# EasyEDA Pro project N630电调_立创EDA专业版工程.epro, schematic Schematic1

## Sheets
1 框图: Board Name: Board1; Create Date: 2025-09-22; Page Name: 框图; Project Name: N630电调; Schematic Name: Schematic1; Update Date: 2025-09-22; Company: 嘉立创EDA; Page Size: A4; Version: V1.0
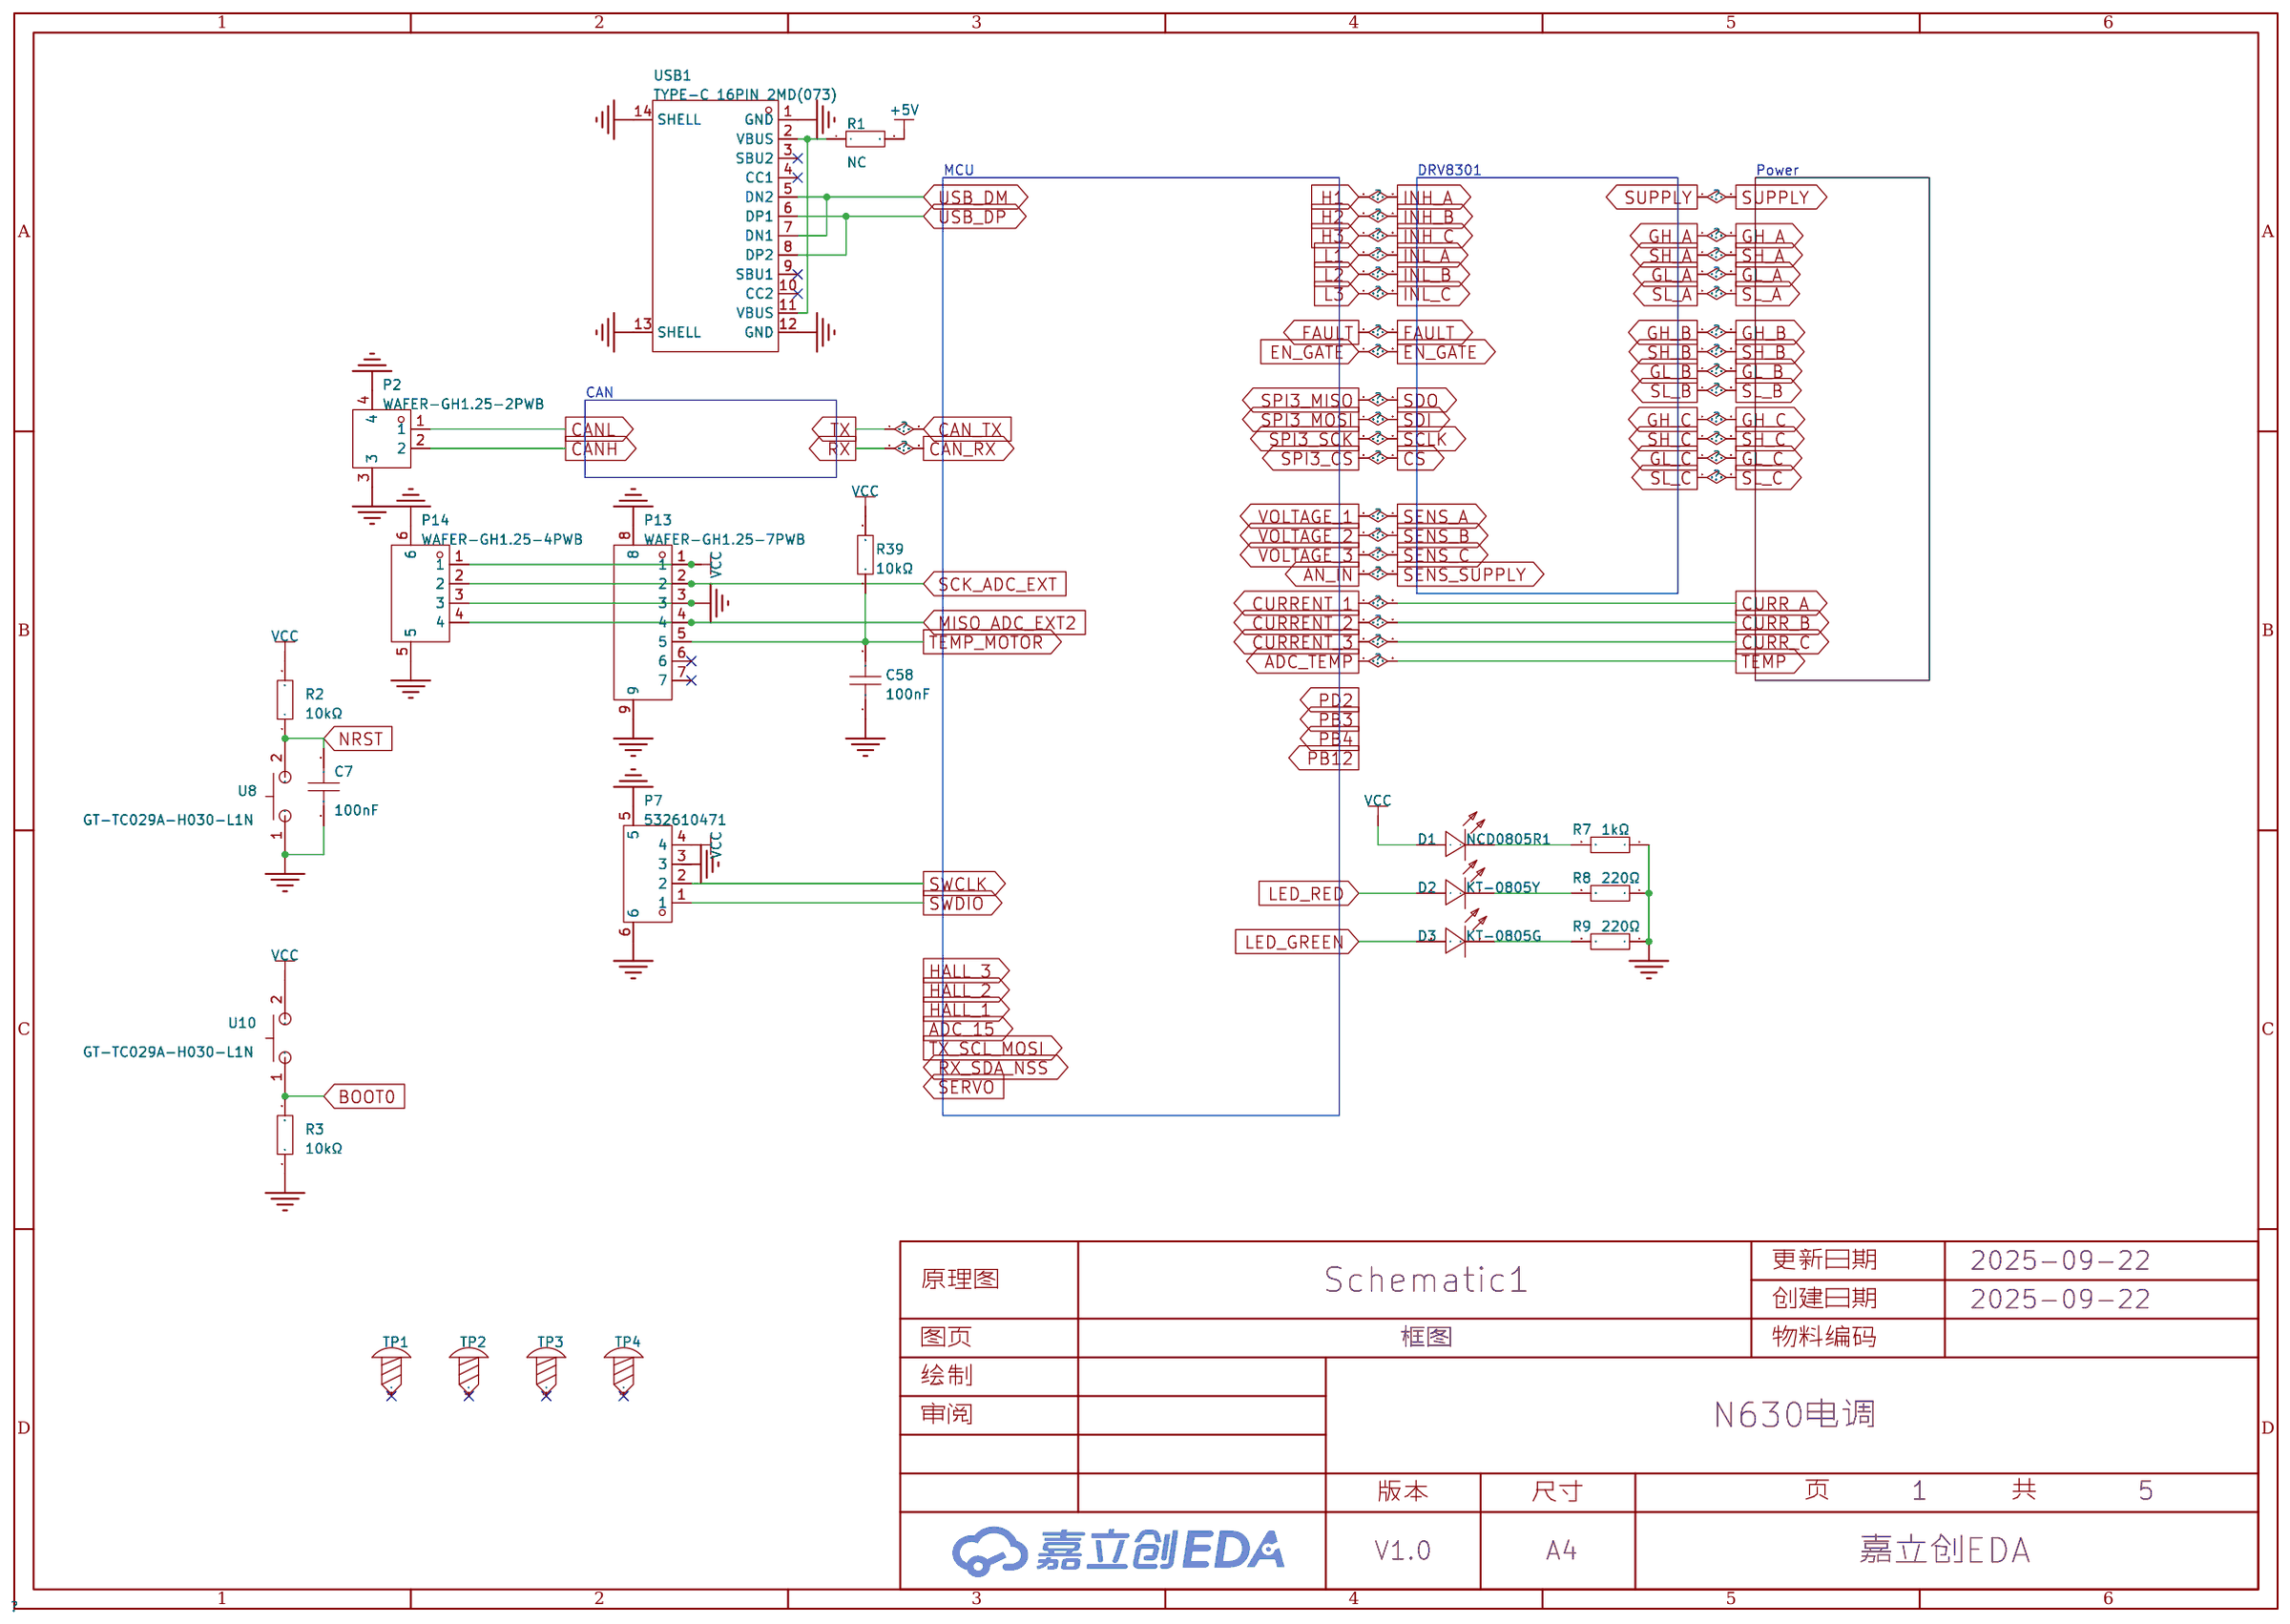
[diagram p0: 框图]
2 MCU: Create Date: 2025-07-19; Page Name: MCU; Project Name: VESC电调_V4; Update Date: 2025-07-19
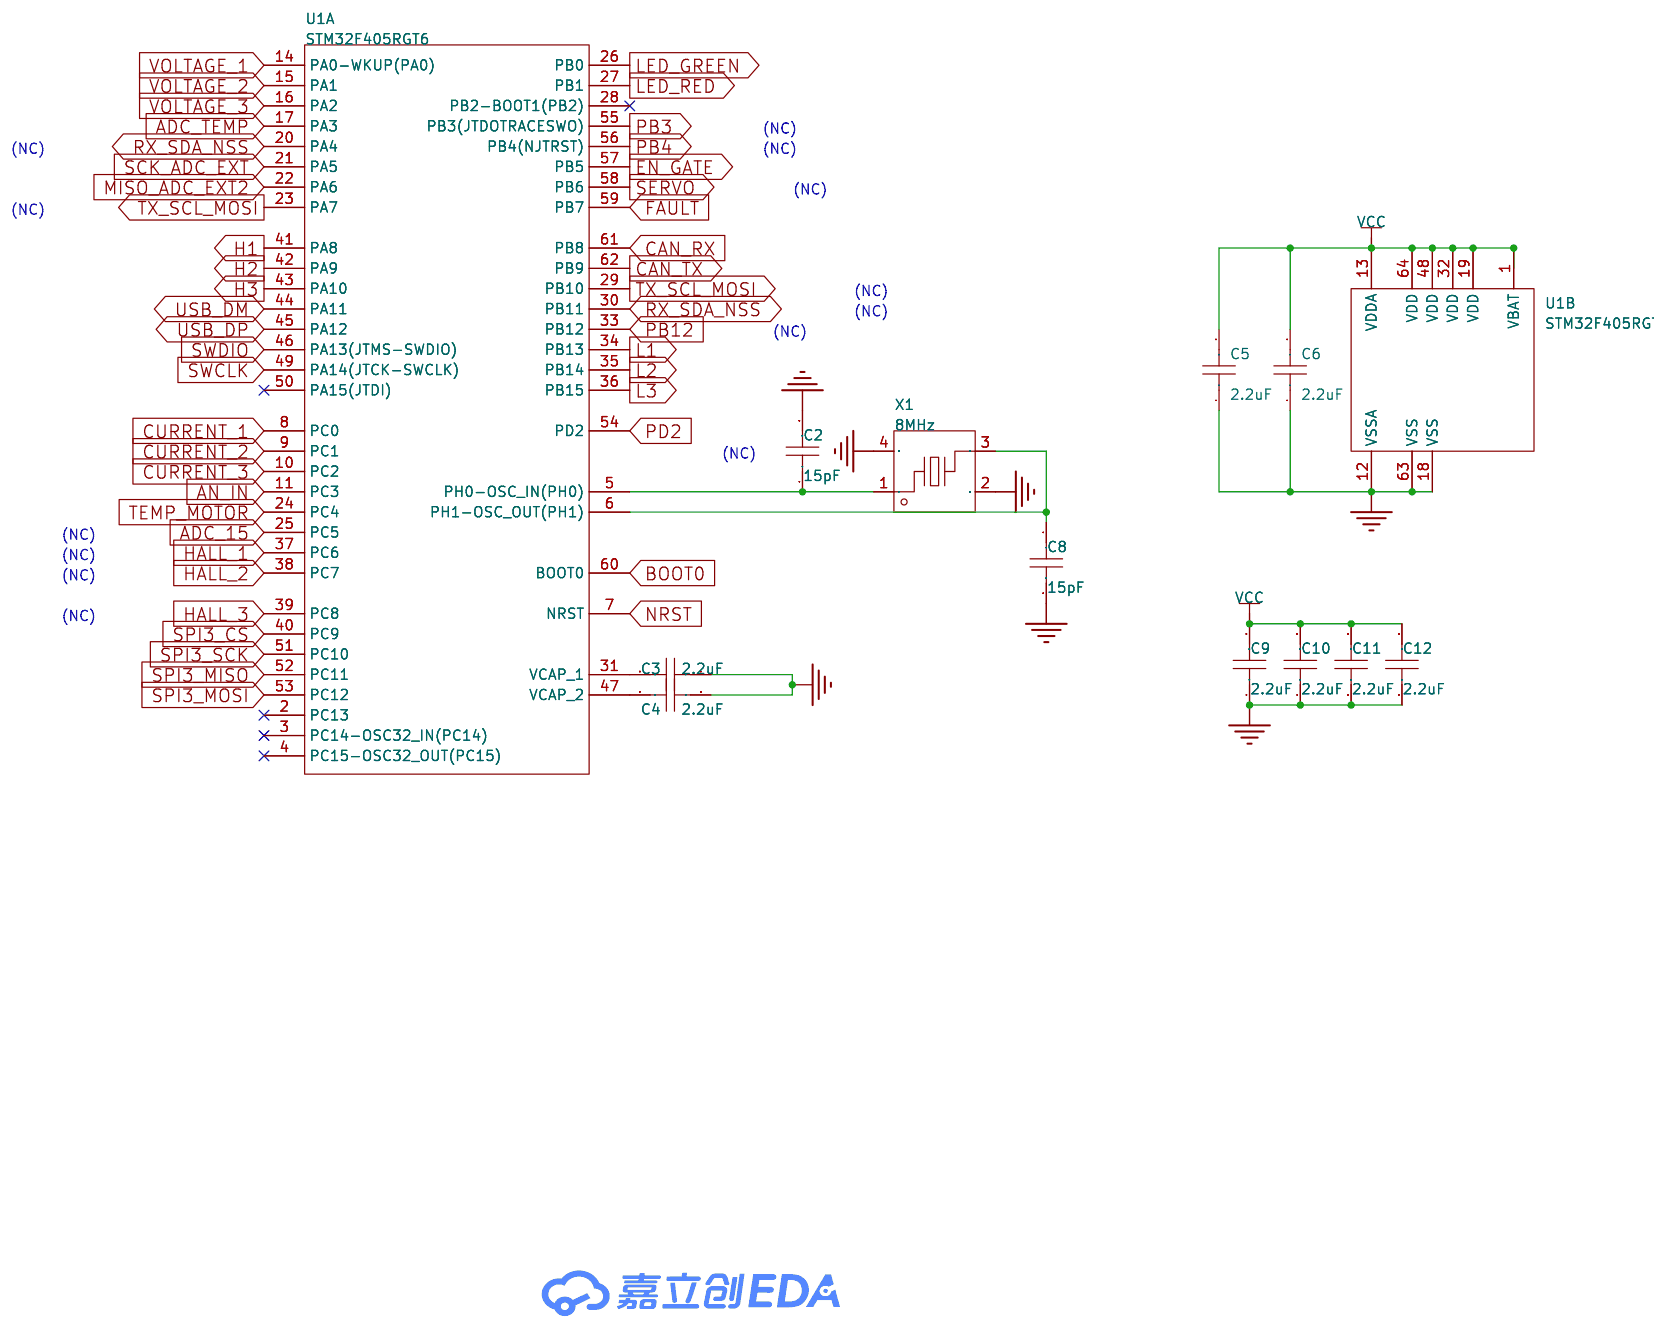
[diagram p1: MCU]
3 DRV8301: Create Date: 2025-08-27; Page Name: DRV8301; Project Name: VESC电调_V5; Update Date: 2025-08-27
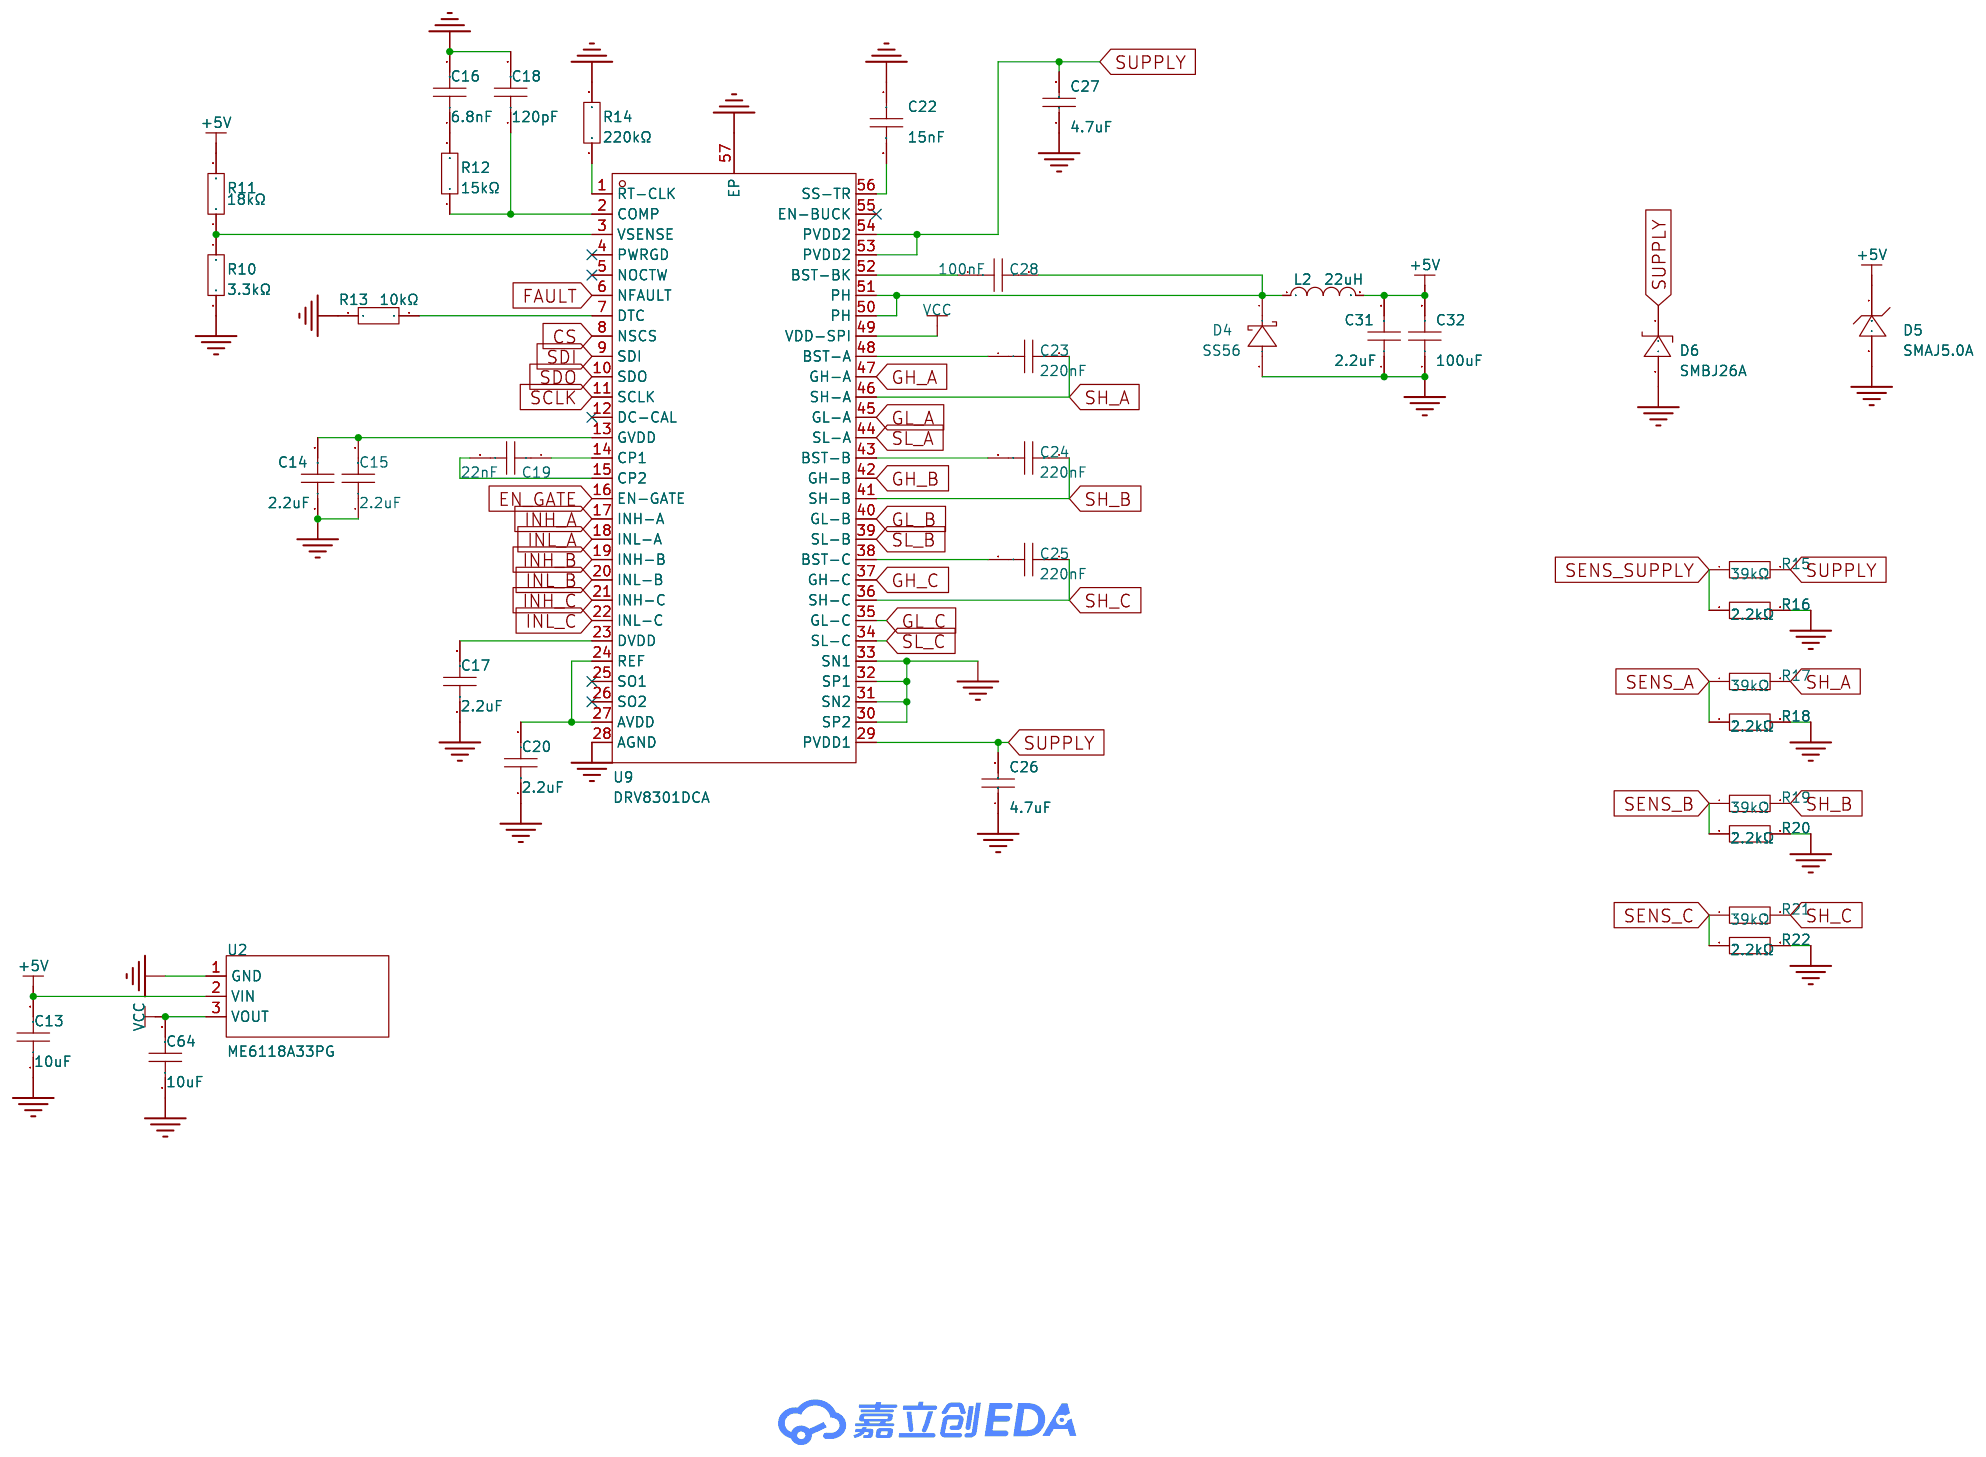
[diagram p2: DRV8301]
4 Power: Create Date: 2025-08-27; Page Name: Power; Project Name: VESC电调_V5; Update Date: 2025-08-27
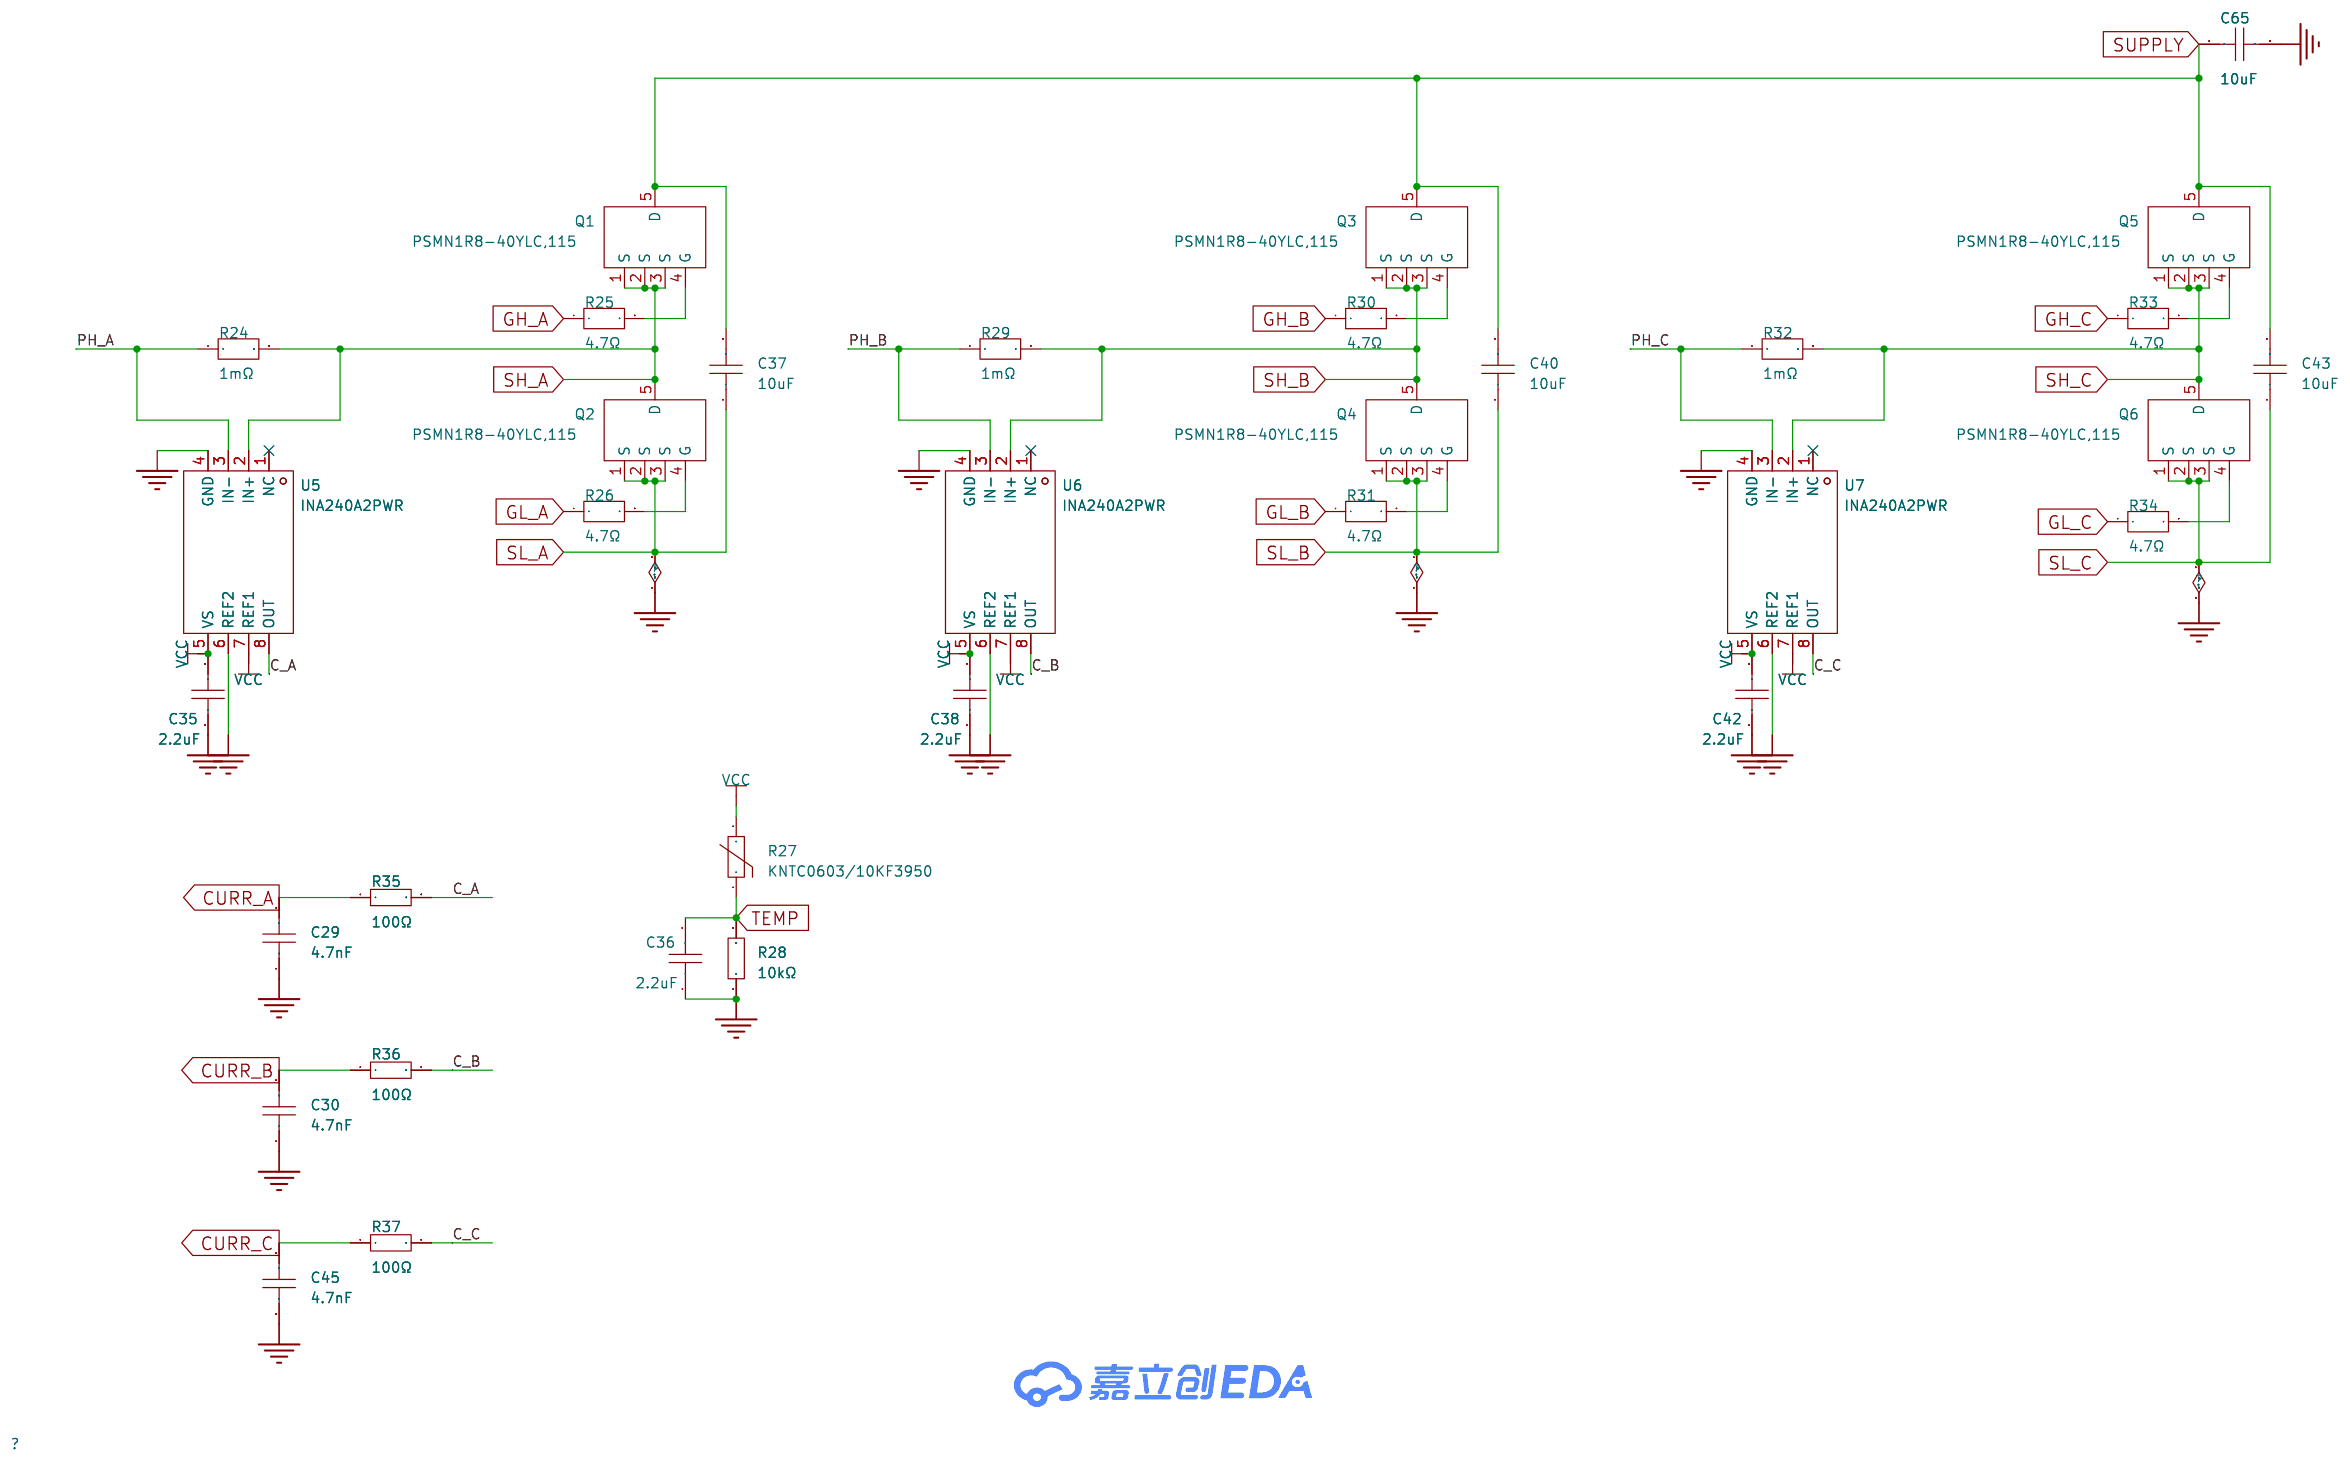
[diagram p3: Power]
5 CAN: Create Date: 2025-09-16; Page Name: CAN; Project Name: N630电调_V6; Update Date: 2025-09-16
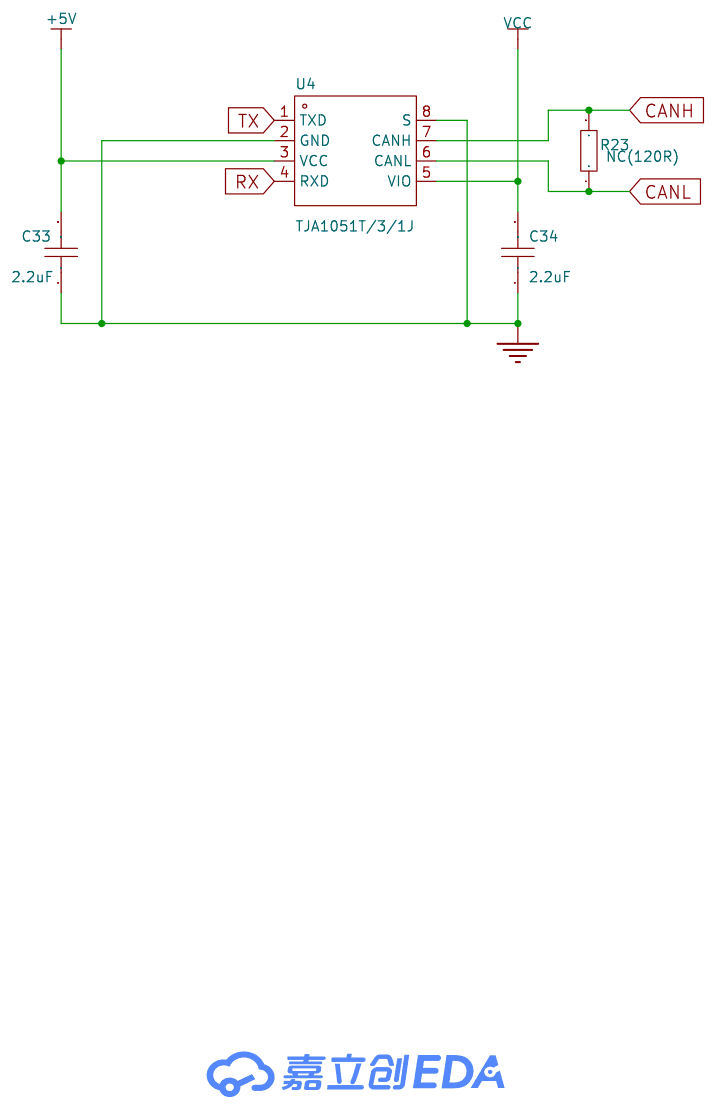
[diagram p4: CAN]

## Parts
sheet CAN
C33  2.2uF  [C0603]
C34  2.2uF  [C0603]
R23  NC(120R)  [R0805]
U4  TJA1051T/3/1J  [SOIC-8_L4.9-W3.9-P1.27-LS6.0-BL]
sheet DRV8301
C13  10uF  [C0603]
C14  2.2uF  [C0603]
C15  2.2uF  [C0603]
C16  6.8nF  [C0603]
C17  2.2uF  [C0603]
C18  120pF  [C0603]
C19  22nF  [C0603]
C20  2.2uF  [C0603]
C22  15nF  [C0603]
C23  220nF  [C0603]
C24  220nF  [C0603]
C25  220nF  [C0603]
C26  4.7uF  [C1206]
C27  4.7uF  [C1206]
C28  100nF  [C0603]
C31  2.2uF  [C0603]
C32  100uF  [C1206]
C64  10uF  [C0603]
D4  SS56  [SMA_L4.3-W2.6-LS5.0-RD]
D5  SMAJ5.0A  [SMA_L4.3-W2.6-LS5.2-RD]
D6  SMBJ26A  [SMB_L4.4-W3.6-LS5.3-L-RD]
L2  22uH  [IND-SMD_L4.6-W4.2_SMMS0420]
R10  3.3kΩ  [R0603]
R11  18kΩ  [R0603]
R12  15kΩ  [R0603]
R13  10kΩ  [R0603]
R14  220kΩ  [R0603]
R15  39kΩ  [R0603]
R16  2.2kΩ  [R0603]
R17  39kΩ  [R0603]
R18  2.2kΩ  [R0603]
R19  39kΩ  [R0603]
R20  2.2kΩ  [R0603]
R21  39kΩ  [R0603]
R22  2.2kΩ  [R0603]
U2  ME6118A33PG  [SOT-89-3_L4.5-W2.5-P1.50-LS4.2-BR]
U9  DRV8301DCA  [HTSSOP-56_L14.0-W6.0-P0.50-LS8.1-BL-EP]
sheet MCU
C2  15pF  [C0603]
C3  2.2uF  [C0603]
C4  2.2uF  [C0603]
C5  2.2uF  [C0603]
C6  2.2uF  [C0603]
C8  15pF  [C0603]
C9  2.2uF  [C0603]
C10  2.2uF  [C0603]
C11  2.2uF  [C0603]
C12  2.2uF  [C0603]
U1  STM32F405RGT6  [LQFP-64_L10.0-W10.0-P0.50-LS12.0-BL]  (sections 1,2)
X1  8MHz  [CRYSTAL-SMD_4P-L3.2-W2.5-BL]
sheet Power
C29  4.7nF  [C0603]
C30  4.7nF  [C0603]
C35  2.2uF  [C0603]
C36  2.2uF  [C0603]
C37  10uF  [C1210]
C38  2.2uF  [C0603]
C40  10uF  [C1210]
C42  2.2uF  [C0603]
C43  10uF  [C1210]
C45  4.7nF  [C0603]
C65  10uF  [C1210]
Q1  PSMN1R8-40YLC,115  [SOT-669_L4.9-W4.0-P1.27-LS6.0-BL]
Q2  PSMN1R8-40YLC,115  [SOT-669_L4.9-W4.0-P1.27-LS6.0-BL]
Q3  PSMN1R8-40YLC,115  [SOT-669_L4.9-W4.0-P1.27-LS6.0-BL]
Q4  PSMN1R8-40YLC,115  [SOT-669_L4.9-W4.0-P1.27-LS6.0-BL]
Q5  PSMN1R8-40YLC,115  [SOT-669_L4.9-W4.0-P1.27-LS6.0-BL]
Q6  PSMN1R8-40YLC,115  [SOT-669_L4.9-W4.0-P1.27-LS6.0-BL]
R24  1mΩ  [RES-SMD_L6.3-W3.2_R2512]
R25  4.7Ω  [R0603]
R26  4.7Ω  [R0603]
R27  KNTC0603/10KF3950  [R0603]
R28  10kΩ  [R0603]
R29  1mΩ  [RES-SMD_L6.3-W3.2_R2512]
R30  4.7Ω  [R0603]
R31  4.7Ω  [R0603]
R32  1mΩ  [RES-SMD_L6.3-W3.2_R2512]
R33  4.7Ω  [R0603]
R34  4.7Ω  [R0603]
R35  100Ω  [R0603]
R36  100Ω  [R0603]
R37  100Ω  [R0603]
U5  INA240A2PWR  [TSSOP-8_L4.4-W3.0-P0.65-LS6.4-BL]
U6  INA240A2PWR  [TSSOP-8_L4.4-W3.0-P0.65-LS6.4-BL]
U7  INA240A2PWR  [TSSOP-8_L4.4-W3.0-P0.65-LS6.4-BL]
sheet 框图
C7  100nF  [C0603]
C58  100nF  [C0603]
D1  NCD0805R1  [LED0805-R-RD]
D2  KT-0805Y  [LED0805-R-RD]
D3  KT-0805G  [LED0805-R-RD]
P2  WAFER-GH1.25-2PWB  [CONN-TH_2P-P1.25_XUNPU_WAFER-GH1.25-2PWB]
P7  532610471  [CONN-SMD_4P-P1.25_53261-0471]
P13  WAFER-GH1.25-7PWB  [CONN-SMD_7P-P1.25_FWF12514-S07B24W5M]
P14  WAFER-GH1.25-4PWB  [CONN-SMD_4P-P1.25_XUNPU_WAFER-GH1.25-4PWB]
R1  NC  [R0402]
R2  10kΩ  [R0603]
R3  10kΩ  [R0603]
R7  1kΩ  [R0603]
R8  220Ω  [R0603]
R9  220Ω  [R0603]
R39  10kΩ  [R0603]
TP1  -  [M2螺丝]
TP2  -  [M2螺丝]
TP3  -  [M2螺丝]
TP4  -  [M2螺丝]
U8  GT-TC029A-H030-L1N  [SW-SMD_L3.9-W2.9-P4.15-LS5.0]
U10  GT-TC029A-H030-L1N  [SW-SMD_L3.9-W2.9-P4.15-LS5.0]
USB1  TYPE-C 16PIN 2MD(073)  [USB-C-SMD_TYPE-C-6PIN-2MD-073]

## Library data of the parts
C3-C6 C9-C12 C14 C15 C17 C20 C31 C33-C36 C38 C42 = CL10A225KO8NNNC: 容值:2.2uF;精度:±10%;额定电压:16V;材质(温度系数):X5R;; LCSC Part Name: 2.2uF ±10% 16V; Supplier Part: C23630; Manufacturer: SAMSUNG(三星); Supplier Footprint: 0603; JLCPCB Part Class: Basic Part; Datasheet: https://atta.szlcsc.com/upload/public/pdf/source/20160218/1457707763339.pdf; Supplier: LCSC; Tolerance: ±10%; Voltage Rated: 16V; Temperature Coefficient: X5R
R23 = 0805W8F1200T5E: 电阻类型:厚膜电阻;阻值:120Ω;精度:±1%;功率:125mW;最大工作电压:150V;温度系数:±100ppm/℃;; LCSC Part Name: 120Ω ±1% 125mW 厚膜电阻; Supplier Part: C17437; Manufacturer: UNI-ROYAL(厚声); Supplier Footprint: 0805; JLCPCB Part Class: Basic Part; Datasheet: https://atta.szlcsc.com/upload/public/pdf/source/20200306/C422600_1E6D84923E4A46A82E41ADD87F860B5C.pdf; Supplier: LCSC; Type: 厚膜电阻; Tolerance: ±1%; Power(Watts): 125mW; Overload Voltage (Max): 150V; Temperature Coefficient: ±100ppm/℃; Operating Temperature Range: -55℃~+155℃; Check: false
U4 = TJA1051T/3/1J: 类型:-;数据速率:5Mbps;; Supplier Part: C38695; Manufacturer: NXP(恩智浦); Supplier Footprint: SOIC-8-150mil; JLCPCB Part Class: 扩展库; Datasheet: https://www.nxp.com/docs/en/data-sheet/TJA1051.pdf; Supplier: LCSC; Data Rate: 5Mbps; Supply Voltage: 4.5V~5.5V; Supply Current: 5mA; Operating Temperature: -40℃~+150℃
C13 C64 = CL10A106KP8NNNC: 容值:10uF;精度:±10%;额定电压:10V;材质(温度系数):X5R;; LCSC Part Name: 10uF ±10% 10V; Supplier Part: C19702; Manufacturer: SAMSUNG(三星); Supplier Footprint: 0603; JLCPCB Part Class: Basic Part; Datasheet: https://atta.szlcsc.com/upload/public/pdf/source/20160218/1457707763339.pdf; Supplier: LCSC; Tolerance: ±10%; Voltage Rated: 10V; Temperature Coefficient: X5R
C16 = 0603B682K500NT: 容值:6.8nF;精度:±10%;额定电压:50V;温度系数:X7R;; LCSC Part Name: 6.8nF ±10% 50V; Supplier Part: C1631; Manufacturer: FH(风华); Supplier Footprint: 0603; JLCPCB Part Class: Basic Part; Datasheet: https://atta.szlcsc.com/upload/public/pdf/source/20200305/C486355_26A10D38EF8C2A5C37091D0039909270.pdf; Supplier: LCSC; Tolerance: ±10%; Voltage Rating: 50V; Temperature Coefficient: X7R
C18 = CC0603JRNPO9BN121: 容值:120pF;精度:±5%;额定电压:50V;材质(温度系数):NP0;; LCSC Part Name: 120pF ±5% 50V; Supplier Part: C107035; Manufacturer: YAGEO(国巨); Supplier Footprint: 0603; JLCPCB Part Class: Extended Part; Datasheet: https://atta.szlcsc.com/upload/public/pdf/source/20170914/C128857_1505359892143968080.pdf; Supplier: LCSC; Tolerance: ±5%; Voltage Rated: 50V; Temperature Coefficient: NP0
C19 = CL10B223KB8NNNC: 容值:22nF;精度:±10%;额定电压:50V;材质(温度系数):X7R;; LCSC Part Name: 22nF ±10% 50V; Supplier Part: C21122; Manufacturer: SAMSUNG(三星); Supplier Footprint: 0603; JLCPCB Part Class: Basic Part; Datasheet: https://atta.szlcsc.com/upload/public/pdf/source/20160218/1457707763339.pdf; Supplier: LCSC; Tolerance: ±10%; Voltage Rated: 50V; Temperature Coefficient: X7R
C22 = CC0603KRX7R9BB153: 容值:15nF;精度:±10%;额定电压:50V;材质(温度系数):X7R;; LCSC Part Name: 15nF ±10% 50V; Supplier Part: C107076; Manufacturer: YAGEO(国巨); Supplier Footprint: 0603; JLCPCB Part Class: Extended Part; Datasheet: https://atta.szlcsc.com/upload/public/pdf/source/20180910/C282072_33301C7F631E79921B82A8DAC6BCC5B3.pdf; Supplier: LCSC; Tolerance: ±10%; Voltage Rated: 50V; Temperature Coefficient: X7R
C23-C25 = CL10B224KA8NNNC: 容值:220nF;精度:±10%;额定电压:25V;材质(温度系数):X7R;; LCSC Part Name: 220nF ±10% 25V; Supplier Part: C21120; Manufacturer: SAMSUNG(三星); Supplier Footprint: 0603; JLCPCB Part Class: Basic Part; Datasheet: https://atta.szlcsc.com/upload/public/pdf/source/20160218/1457707763339.pdf; Supplier: LCSC; Tolerance: ±10%; Voltage Rated: 25V; Temperature Coefficient: X7R
C26 C27 = 1206B475K500NT: 容值:4.7uF;精度:±10%;额定电压:50V;温度系数:X7R;; LCSC Part Name: 4.7uF ±10% 50V; Supplier Part: C29823; Manufacturer: FH(风华); Supplier Footprint: 1206; JLCPCB Part Class: Basic Part; Datasheet: https://atta.szlcsc.com/upload/public/pdf/source/20200305/C486355_26A10D38EF8C2A5C37091D0039909270.pdf; Supplier: LCSC; Tolerance: ±10%; Voltage Rating: 50V; Temperature Coefficient: X7R
C7 C28 C58 = CC0603KRX7R9BB104: 容值:100nF;精度:±10%;额定电压:50V;温度系数:X7R;; LCSC Part Name: 100nF ±10% 50V; Supplier Part: C14663; Manufacturer: YAGEO(国巨); Supplier Footprint: 0603; JLCPCB Part Class: Basic Part; Datasheet: https://atta.szlcsc.com/upload/public/pdf/source/20180910/C282072_33301C7F631E79921B82A8DAC6BCC5B3.pdf; Supplier: LCSC; Tolerance: ±10%; Voltage Rating: 50V; Temperature Coefficient: X7R
C32 = CL31A107MQHNNNE: 容值:100uF;精度:±20%;额定电压:6.3V;材质(温度系数):X5R;; LCSC Part Name: 100uF ±20% 6.3V; Supplier Part: C15008; Manufacturer: SAMSUNG(三星); Supplier Footprint: 1206; JLCPCB Part Class: Basic Part; Datasheet: https://atta.szlcsc.com/upload/public/pdf/source/20160218/1457707763339.pdf; Supplier: LCSC; Tolerance: ±20%; Voltage Rated: 6.3V; Temperature Coefficient: X5R
D4 = SS56_C18199169: 二极管配置:独立式;正向压降(Vf):700mV@5.0A;直流反向耐压(Vr):60V;整流电流:5A;; LCSC Part Name: 电压:60V 电流:5A; Supplier Part: C18199169; Manufacturer: 宏迦橙; Supplier Footprint: SMA(DO-214AC); JLCPCB Part Class: 扩展库; Datasheet: https://atta.szlcsc.com/upload/public/pdf/source/20230828/254C3882F8647358AD9F60DD73611B5E.pdf; Supplier: LCSC; Diode Configuration: 独立式; Forward Voltage (Vf@If): 700mV@5.0A; Reverse Voltage (Vr): 60V; Rectified Current: 5A; Reverse Leakage Current (Ir): 200uA@60V
D5 = SMAJ5.0A_C83329: 极性:单向;反向截止电压(Vrwm):5V;钳位电压:9.2V;峰值脉冲电流(Ipp):43.5A;峰值脉冲功率(Ppp):400W;击穿电压:6.4V;; LCSC Part Name: 耐压/V 5V-440V 峰值脉冲功率 400W; Supplier Part: C83329; Manufacturer: Littelfuse(美国力特); Supplier Footprint: DO-214AC(SMA); JLCPCB Part Class: Extended Part; Datasheet: https://item.szlcsc.com/datasheet/SMAJ5.0A/84493.html; Supplier: LCSC; Polarity: 单向; Reverse Stand-Off Voltage (Vrwm): 5V; Clamping Voltage: 9.2V; Peak Pulse Current (Ipp): 43.5A; Peak Pulse Power Dissipation (Ppp): 400W; Voltage - Breakdown: 6.4V; Reverse Leakage Current (Ir): 800uA; Operating Temperature: -65℃~+150℃; Type: TVS
D6 = SMBJ26A_C315992: 极性:单向;反向截止电压(Vrwm):26V;最大钳位电压:42.1V;峰值脉冲电流(Ipp)@10/1000us:14.3A;峰值脉冲功率(Ppp)@10/1000us:600W;击穿电压:28.9V;; Supplier Part: C315992; Manufacturer: Littelfuse(美国力特); Supplier Footprint: SMB; JLCPCB Part Class: 扩展库; Datasheet: https://atta.szlcsc.com/upload/public/pdf/source/20190807/C409416_D98C874D944FBE9BE31A2BD6B7A21533.pdf; Supplier: LCSC; polarity: 单向; Reverse Stand-Off Voltage (Vrwm): 26V; Maximum Clamping Voltage: 42.1V; Peak Pulse Current (Ipp)@10/1000us: 14.3A; Peak Pulse Power Dissipation (Ppp)@10/1000us: 600W; Breakdown Voltage: 28.9V; Type: TVS
L2 = SMMS0420-220M: 电感值:22uH;精度:±20%;额定电流:1.2A;饱和电流(Isat):1.5A;类型:一体成型电感;; LCSC Part Name: 22uH ±20% 1.5A; Supplier Part: C2894720; Manufacturer: SXN(顺翔诺); Supplier Footprint: SMD,4.6x4.2x2mm; JLCPCB Part Class: 扩展库; Datasheet: https://atta.szlcsc.com/upload/public/pdf/source/20210910/523B6BB0C4A09F37806A127B1ABE761D.pdf; Supplier: LCSC; Tolerance: ±20%; Rated Current: 1.2A; Saturation Current (Isat): 1.5A; DC Resistance (DCR): 510mΩ; Type: 一体成型电感
R10 = 0603WAF3301T5E: 电阻类型:厚膜电阻;阻值:3.3kΩ;精度:±1%;功率:100mW;最大工作电压:75V;温度系数:±100ppm/℃;; LCSC Part Name: 3.3kΩ ±1% 100mW 厚膜电阻; Supplier Part: C22978; Manufacturer: UNI-ROYAL(厚声); Supplier Footprint: 0603; JLCPCB Part Class: Basic Part; Datasheet: https://atta.szlcsc.com/upload/public/pdf/source/20200306/C422600_1E6D84923E4A46A82E41ADD87F860B5C.pdf; Supplier: LCSC; Type: 厚膜电阻; Tolerance: ±1%; Power(Watts): 100mW; Overload Voltage (Max): 75V; Temperature Coefficient: ±100ppm/℃; Operating Temperature Range: -55℃~+155℃
R11 = 0603WAF1802T5E: 电阻类型:厚膜电阻;阻值:18kΩ;精度:±1%;功率:100mW;最大工作电压:75V;温度系数:±100ppm/℃;; LCSC Part Name: 18kΩ ±1% 100mW 厚膜电阻; Supplier Part: C25810; Manufacturer: UNI-ROYAL(厚声); Supplier Footprint: 0603; JLCPCB Part Class: Basic Part; Datasheet: https://atta.szlcsc.com/upload/public/pdf/source/20200306/C422600_1E6D84923E4A46A82E41ADD87F860B5C.pdf; Supplier: LCSC; Type: 厚膜电阻; Tolerance: ±1%; Power(Watts): 100mW; Overload Voltage (Max): 75V; Temperature Coefficient: ±100ppm/℃; Operating Temperature Range: -55℃~+155℃
R12 = 0603WAF1502T5E: 电阻类型:厚膜电阻;阻值:15kΩ;精度:±1%;功率:100mW;最大工作电压:75V;温度系数:±100ppm/℃;; LCSC Part Name: 15kΩ ±1% 100mW 厚膜电阻; Supplier Part: C22809; Manufacturer: UNI-ROYAL(厚声); Supplier Footprint: 0603; JLCPCB Part Class: Basic Part; Datasheet: https://atta.szlcsc.com/upload/public/pdf/source/20200306/C422600_1E6D84923E4A46A82E41ADD87F860B5C.pdf; Supplier: LCSC; Type: 厚膜电阻; Tolerance: ±1%; Power(Watts): 100mW; Overload Voltage (Max): 75V; Temperature Coefficient: ±100ppm/℃; Operating Temperature Range: -55℃~+155℃
R2 R3 R13 = 0603WAF1002T5E: 电阻类型:厚膜电阻;阻值:10kΩ;精度:±1%;功率:100mW;工作电压:75V;温度系数:±100ppm/℃;; LCSC Part Name: 厚膜电阻 10kΩ ±1% 100mW; Supplier Part: C25804; Manufacturer: UNI-ROYAL(厚声); Supplier Footprint: 0603; JLCPCB Part Class: Basic Part; Datasheet: https://atta.szlcsc.com/upload/public/pdf/source/20200306/C422600_1E6D84923E4A46A82E41ADD87F860B5C.pdf; Supplier: LCSC; Type: 厚膜电阻; Tolerance: ±1%; Power(Watts): 100mW; Overload Voltage (Max): 75V; Temperature Coefficient: ±100ppm/℃; Operating Temperature Range: -55℃~+155℃; Voltage-Supply(Max): 75V; Operating Temperature: -55℃~+155℃
R14 = 0603WAF2203T5E: 电阻类型:厚膜电阻;阻值:220kΩ;精度:±1%;功率:100mW;最大工作电压:75V;温度系数:±100ppm/℃;; LCSC Part Name: 220kΩ ±1% 100mW 厚膜电阻; Supplier Part: C22961; Manufacturer: UNI-ROYAL(厚声); Supplier Footprint: 0603; JLCPCB Part Class: Basic Part; Datasheet: https://atta.szlcsc.com/upload/public/pdf/source/20200306/C422600_1E6D84923E4A46A82E41ADD87F860B5C.pdf; Supplier: LCSC; Type: 厚膜电阻; Tolerance: ±1%; Power(Watts): 100mW; Overload Voltage (Max): 75V; Temperature Coefficient: ±100ppm/℃; Operating Temperature Range: -55℃~+155℃
R15 R17 R19 R21 = 0603WAF3902T5E: 电阻类型:厚膜电阻;阻值:39kΩ;精度:±1%;功率:100mW;最大工作电压:75V;温度系数:±100ppm/℃;; LCSC Part Name: 39kΩ ±1% 100mW 厚膜电阻; Supplier Part: C23153; Manufacturer: UNI-ROYAL(厚声); Supplier Footprint: 0603; JLCPCB Part Class: Basic Part; Datasheet: https://atta.szlcsc.com/upload/public/pdf/source/20200306/C422600_1E6D84923E4A46A82E41ADD87F860B5C.pdf; Supplier: LCSC; Type: 厚膜电阻; Tolerance: ±1%; Power(Watts): 100mW; Overload Voltage (Max): 75V; Temperature Coefficient: ±100ppm/℃; Operating Temperature Range: -55℃~+155℃
R16 R18 R20 R22 = 0603WAF2201T5E: 电阻类型:厚膜电阻;阻值:2.2kΩ;精度:±1%;功率:100mW;最大工作电压:75V;温度系数:±100ppm/℃;; LCSC Part Name: 2.2kΩ ±1% 100mW 厚膜电阻; Supplier Part: C4190; Manufacturer: UNI-ROYAL(厚声); Supplier Footprint: 0603; JLCPCB Part Class: Basic Part; Datasheet: https://atta.szlcsc.com/upload/public/pdf/source/20200306/C422600_1E6D84923E4A46A82E41ADD87F860B5C.pdf; Supplier: LCSC; Type: 厚膜电阻; Tolerance: ±1%; Power(Watts): 100mW; Overload Voltage (Max): 75V; Temperature Coefficient: ±100ppm/℃; Operating Temperature Range: -55℃~+155℃
U2 = ME6118A33PG: 输出类型:固定;工作电压:18V;输出电压:3.3V;输出电流:800mA;电源纹波抑制比(PSRR):-;输出极性:正极;; Supplier Part: C236721; Manufacturer: MICRONE(南京微盟); Supplier Footprint: SOT-89-3; JLCPCB Part Class: 扩展库; Datasheet: https://atta.szlcsc.com/upload/public/pdf/source/20180709/C236722_8C795604A62DB63E4DCCB1C55FB5CFAC.pdf; Supplier: LCSC; Output Type: 固定; Voltage - Supply: 18V; Output Voltage: 3.3V; Output Current: 800mA; Features: 热关断(TSD)；过流保护(OCP); Operating Temperature: -40℃~+125℃; Output Configuration: 正极; Number of Outputs: 1
U9 = DRV8301DCA: DRV8301 具有降压稳压器、电流分流放大器和 SPI 的最大 65V 三相栅极驱动器; Supplier Part: C92113; Manufacturer: TI(德州仪器); Supplier Footprint: HTSSOP-56-EP-6mm; JLCPCB Part Class: Extended Part; Datasheet: https://www.ti.com/cn/lit/gpn/drv8301; Supplier: LCSC
C2 C8 = CL10C150JB8NNNC: 容值:15pF;精度:±5%;额定电压:50V;材质(温度系数):C0G;; LCSC Part Name: 15pF ±5% 50V; Supplier Part: C1644; Manufacturer: SAMSUNG(三星); Supplier Footprint: 0603; JLCPCB Part Class: Basic Part; Datasheet: https://atta.szlcsc.com/upload/public/pdf/source/20160218/1457707763339.pdf; Supplier: LCSC; Tolerance: ±5%; Voltage Rated: 50V; Temperature Coefficient: C0G
U1 = STM32F405RGT6: CPU内核:ARM-M4;CPU最大主频:168MHz;应用领域:-;; LCSC Part Name: 带DSP和FPU的高性能基础系列ARM Cortex-M4 MCU，具有1 MB Flash、168 MHz CPU和ART加速器; Supplier Part: C15742; Manufacturer: ST(意法半导体); Supplier Footprint: LQFP-64(10x10); JLCPCB Part Class: 扩展库; Datasheet: https://atta.szlcsc.com/upload/public/pdf/source/20140801/1457707197138.pdf; Supplier: LCSC; CPU Core: ARM-M4; CPU Maximum Speed: 168MHz; Program Storage Size: 1MB; Program Memory Type: FLASH; Number of I/O: 51; ADC (Bit): 12bit; DAC (Bit): 12bit; Low Voltage Detection Threshold: 1.8V~3.6V
X1 = X32258MSB4SI: 晶振类型:贴片晶振;频率:8MHz;常温频差:±10ppm;负载电容:20pF;频率稳定度:±20ppm;; LCSC Part Name: 8MHz ±10ppm 20pF; Supplier Part: C2682774; Manufacturer: YXC(扬兴晶振); Supplier Footprint: SMD3225-4P; JLCPCB Part Class: 扩展库; Datasheet: https://atta.szlcsc.com/upload/public/pdf/source/20240329/19D5F850207469550BEB00D7DFEDBC7A.pdf; Supplier: LCSC; Type: 贴片晶振; Normal temperature Frequency Tolerance: ±10ppm; Load Capacitance: 20pF; Frequency Stability: ±20ppm; Operating Temperature: -40℃~+85℃
C29 C30 C45 = 0603B472K500NT: 容值:4.7nF;精度:±10%;额定电压:50V;温度系数:X7R;; LCSC Part Name: 4.7nF ±10% 50V; Supplier Part: C53987; Manufacturer: FH(风华); Supplier Footprint: 0603; JLCPCB Part Class: Basic Part; Datasheet: https://atta.szlcsc.com/upload/public/pdf/source/20200305/C486355_26A10D38EF8C2A5C37091D0039909270.pdf; Supplier: LCSC; Tolerance: ±10%; Voltage Rating: 50V; Temperature Coefficient: X7R
C37 C40 C43 C65 = CL32B106KBJNNNE: 容值:10uF;精度:±10%;额定电压:50V;温度系数:X7R;; LCSC Part Name: 10uF ±10% 50V; Supplier Part: C138687; Manufacturer: SAMSUNG(三星); Supplier Footprint: 1210; JLCPCB Part Class: Extended Part; Datasheet: https://item.szlcsc.com/datasheet/CL32B106KBJNNNE/150006.html; Supplier: LCSC; Tolerance: ±10%; Voltage Rating: 50V; Temperature Coefficient: X7R
Q1-Q6 = PSMN1R8-40YLC,115: 类型:1个N沟道;漏源电压(Vdss):40V;连续漏极电流(Id):100A;导通电阻(RDS(on)@Vgs,Id):1.8mΩ@4.5V,25A;功率(Pd):272W;阈值电压(Vgs(th)@Id):1.45V@1mA;; LCSC Part Name: 1个N沟道 耐压:40V 电流:100A; Supplier Part: C88071; Manufacturer: Nexperia(安世); Supplier Footprint: SOT-669; JLCPCB Part Class: Extended Part; Datasheet: https://atta.szlcsc.com/upload/public/pdf/source/20240724/49B17F7567C3E80388910F90216ECF99.pdf; Supplier: LCSC; Type: 1个N沟道; Drain Source Voltage (Vdss): 40V; Continuous Drain Current (Id): 100A; Drain Source On Resistance (RDS(on)@Vgs,Id): 1.8mΩ@4.5V,25A; Power Dissipation (Pd): 272W; Gate Threshold Voltage (Vgs(th)@Id): 1.45V@1mA; Total Gate Charge (Qg@Vgs): 45nC@4.5V; Input Capacitance (Ciss@Vds): 6.68nF@20V; Reverse Transfer Capacitance (Crss@Vds): 310pF@20V; Operating Temperature: -55℃~+175℃
R24 R29 R32 = RE2512F3R001: 电阻类型:采样电阻;阻值:1mΩ;精度:±1%;功率:3W;温度系数:±50ppm/℃;; LCSC Part Name: 1mΩ 3W 2512 ±1%; Supplier Part: C46961745; Manufacturer: 捷而瑞; Supplier Footprint: 2512; JLCPCB Part Class: Extended Part; Datasheet: https://atta.szlcsc.com/upload/public/pdf/source/20250325/401775B85EF7B3A580BC34DFED100CB2.pdf; Supplier: LCSC; Type: 采样电阻; Tolerance: ±1%; Power(Watts): 3W; Temperature Coefficient: ±50ppm/℃
R25 R26 R30 R31 R33 R34 = 0603WAF470KT5E: 电阻类型:厚膜电阻;阻值:4.7Ω;精度:±1%;功率:100mW;最大工作电压:75V;温度系数:±400ppm/℃;; LCSC Part Name: 4.7Ω ±1% 100mW 厚膜电阻; Supplier Part: C23164; Manufacturer: UNI-ROYAL(厚声); Supplier Footprint: 0603; JLCPCB Part Class: Basic Part; Datasheet: https://atta.szlcsc.com/upload/public/pdf/source/20200306/C422600_1E6D84923E4A46A82E41ADD87F860B5C.pdf; Supplier: LCSC; Type: 厚膜电阻; Tolerance: ±1%; Power(Watts): 100mW; Overload Voltage (Max): 75V; Temperature Coefficient: ±400ppm/℃; Operating Temperature Range: -55℃~+155℃
R27 = KNTC0603/10KF3950: 阻值:10kΩ;B值(25℃/50℃):3950K;功率:100mW;B值精度:±1%;最大稳态电流(25℃):310uA;; Supplier Part: C2892547; Manufacturer: KUU; Supplier Footprint: 0603; JLCPCB Part Class: 扩展库; Datasheet: https://atta.szlcsc.com/upload/public/pdf/source/20210908/154E92DD1F52D9B3804AA862EC2D5FAB.pdf; Supplier: LCSC; Resistance @ 25℃: 10kΩ; B Constant (25℃/50℃): 3950K; B Constant (25℃/85℃): 3987K; Power(Watts): 100mW; B Constant Tolerance: ±1%; Steady State Current (Max): 310uA; Operating Temperature: -40℃~+125℃
R28 R39 = 0603WAF1002T5E: 电阻类型:厚膜电阻;阻值:10kΩ;精度:±1%;功率:100mW;工作电压:75V;温度系数:±100ppm/℃;; LCSC Part Name: 厚膜电阻 10kΩ ±1% 100mW; Supplier Part: C25804; Manufacturer: UNI-ROYAL(厚声); Supplier Footprint: 0603; JLCPCB Part Class: 基础库; Datasheet: https://atta.szlcsc.com/upload/public/pdf/source/20200306/C422600_1E6D84923E4A46A82E41ADD87F860B5C.pdf; Supplier: LCSC; Type: 厚膜电阻; Tolerance: ±1%; Power(Watts): 100mW; Overload Voltage (Max): 75V; Temperature Coefficient: ±100ppm/℃; Operating Temperature Range: -55℃~+155℃; Voltage-Supply(Max): 75V; Operating Temperature: -55℃~+155℃
R35-R37 = 0603WAF1000T5E: 电阻类型:厚膜电阻;阻值:100Ω;精度:±1%;功率:100mW;最大工作电压:75V;温度系数:±200ppm/℃;; LCSC Part Name: 100Ω ±1% 100mW 厚膜电阻; Supplier Part: C22775; Manufacturer: UNI-ROYAL(厚声); Supplier Footprint: 0603; JLCPCB Part Class: Basic Part; Datasheet: https://atta.szlcsc.com/upload/public/pdf/source/20200306/C422600_1E6D84923E4A46A82E41ADD87F860B5C.pdf; Supplier: LCSC; Type: 厚膜电阻; Tolerance: ±1%; Power(Watts): 100mW; Overload Voltage (Max): 75V; Temperature Coefficient: ±200ppm/℃; Operating Temperature Range: -55℃~+155℃
U5-U7 = INA240A2PWR: 放大器数:单路;; Supplier Part: C129949; Manufacturer: TI(德州仪器); Supplier Footprint: TSSOP-8; JLCPCB Part Class: Extended Part; Datasheet: https://www.ti.com/cn/lit/gpn/ina240; Supplier: LCSC; Number of Channels: 单路; Supply Current: 1.8mA; Operating Temperature: -40℃~+125℃
D1 = NCD0805R1: 灯头类型:-;发光颜色:红色;正向电压(VF):1.6V~2.6V;功率:65mW;正向电流:20mA;主波长:615nm~630nm;二极管配置:独立二极管;透镜颜色:无色透明透镜;色温:-;发光强度:67mcd~195mcd;发光角度:130°;载带方式:-;工作温度:-30℃~+85℃;; Supplier Part: C84256; Manufacturer: 国星光电; Supplier Footprint: 0805; JLCPCB Part Class: Basic Part; Datasheet: https://atta.szlcsc.com/upload/public/pdf/source/20200820/C84256_F0A75A43B3EAD75808600A0514C76B99.pdf; Supplier: LCSC; Emitted Color: 红色; Forward Voltage (VF): 1.6V~2.6V; Power Dissipation: 65mW; Forward Current: 20mA; Dominant Wavelength: 615nm~630nm; Diode Configuration: 独立二极管; Lens Color: 无色透明透镜; Luminous Intensity: 67mcd~195mcd; Viewing Angle: 130°; Operating Temperature: -30℃~+85℃
D2 = KT-0805Y: 发光颜色:黄色;功率:-;正向电流:-;主波长:-;二极管配置:-;透镜颜色:-;色温:-;发光角度:-;载带方式:-;工作温度:-;; LCSC Part Name: 0805 黄灯 高亮; Supplier Part: C2296; Manufacturer: KENTO; Supplier Footprint: 0805; JLCPCB Part Class: Basic Part; Datasheet: https://atta.szlcsc.com/upload/public/pdf/source/20160421/1461205044170.pdf; Supplier: LCSC; Emitted Color: 黄色
D3 = KT-0805G: 灯头类型:-;发光颜色:翠绿色;正向电压(VF):-;功率:-;正向电流:-;主波长:-;二极管配置:-;透镜颜色:-;色温:-;发光强度:-;发光角度:-;载带方式:-;工作温度:-;; LCSC Part Name: 0805 翠绿 高亮; Supplier Part: C2297; Manufacturer: KENTO; Supplier Footprint: 0805; JLCPCB Part Class: Basic Part; Datasheet: https://atta.szlcsc.com/upload/public/pdf/source/20170209/1486607340485.pdf; Supplier: LCSC; Emitted Color: 翠绿色
P2 = WAFER-GH1.25-2PWB: 插针结构:1x2P;间距:1.25mm;安装方式:卧贴;参考系列:GH;总PIN数:2P;排数:1;每排PIN数:2;行距:-;额定电流:1A;触头材质:黄铜;触头镀层:-;工作温度范围:-25℃~+85℃;; LCSC Part Name: 1x2P 间距:1.25mm 卧贴 系列:GH; Supplier Part: C3029377; Manufacturer: XUNPU(讯普); Supplier Footprint: SMD,P=1.25mm,卧贴; JLCPCB Part Class: Extended Part; Datasheet: https://atta.szlcsc.com/upload/public/pdf/source/20220527/CB8773BFB0913C3B8ABD62CB38BA101A.pdf; Supplier: LCSC; Pins Structure: 1x2P; Pitch: 1.25mm; Mounting Type: 卧贴; Reference Series: GH; Number of Pins: 2P; Number of Rows: 1; Number of PINs Per Row: 2; Current Rating: 1A; Contact Material: 黄铜; Operating Temperature: -25℃~+85℃; Voltage Rating: 125V; Plastic Material: LCP; Supplementary Features: 辅助焊脚; Color: 米色; Z-Height of the Board: 4.35mm; X-Length of Bottom Edge on Board (Spacing Line): 5.75mm; Y-Width of Bottom Edge on Board: 5mm
P7 = 532610471: 插针结构:1x4P;间距:1.25mm;安装方式:卧贴;参考系列:PicoBlade(MX 1.25);总PIN数:4P;排数:1;每排PIN数:4;行距:-;额定电流:1A;触头材质:磷青铜;触头镀层:锡;工作温度范围:-40℃~+105℃;; LCSC Part Name: 1x4P 间距:1.25mm 卧贴 系列:PicoBlade(MX 1.25); Supplier Part: C240847; Manufacturer: MOLEX; Supplier Footprint: SMD,P=1.25mm; JLCPCB Part Class: Extended Part; Datasheet: https://www.molex.com/content/dam/molex/molex-dot-com/products/automated/en-us/salesdrawingpdf/532/53261/532610471_sd.pdf?inline; Supplier: LCSC; Pins Structure: 1x4P; Pitch: 1.25mm; Mounting Type: 卧贴; Reference Series: PicoBlade(MX 1.25); Number of Pins: 4P; Number of Rows: 1; Number of PINs Per Row: 4; Current Rating: 1A; Contact Material: 磷青铜; Contact Plating: 锡; Operating Temperature: -40℃~+105℃; Voltage Rating: 125V; Plastic Material: 玻纤增强PA; Flame Retardant Rating: UL94V-0; Supplementary Features: 辅助焊脚; Color: 白色; Z-Height of the Board: 3.4mm; X-Length of Bottom Edge on Board (Spacing Line): 10.15mm; Y-Width of Bottom Edge on Board: 5.2mm
P13 = WAFER-GH1.25-7PWB: 插针结构:1x7P;间距:1.25mm;安装方式:卧贴;参考系列:GH;总PIN数:7P;排数:1;每排PIN数:7;行距:-;额定电流:1A;触头材质:黄铜;触头镀层:-;工作温度范围:-25℃~+85℃;; LCSC Part Name: 1x7P 间距:1.25mm 卧贴 系列:GH; Supplier Part: C3029382; Manufacturer: XUNPU(讯普); Supplier Footprint: SMD,P=1.25mm,卧贴; JLCPCB Part Class: Extended Part; Datasheet: https://atta.szlcsc.com/upload/public/pdf/source/20220527/CB8773BFB0913C3B8ABD62CB38BA101A.pdf; Supplier: LCSC; Pins Structure: 1x7P; Pitch: 1.25mm; Mounting Type: 卧贴; Reference Series: GH; Number of Pins: 7P; Number of Rows: 1; Number of PINs Per Row: 7; Current Rating: 1A; Contact Material: 黄铜; Operating Temperature: -25℃~+85℃; Voltage Rating: 125V; Plastic Material: LCP; Supplementary Features: 辅助焊脚; Color: 米色; Z-Height of the Board: 4.35mm; X-Length of Bottom Edge on Board (Spacing Line): 12mm; Y-Width of Bottom Edge on Board: 5mm
P14 = WAFER-GH1.25-4PWB: 插针结构:1x4P;间距:1.25mm;安装方式:卧贴;参考系列:GH;总PIN数:4P;排数:1;每排PIN数:4;行距:-;额定电流:1A;触头材质:黄铜;触头镀层:-;工作温度范围:-25℃~+85℃;; LCSC Part Name: 1x4P 间距:1.25mm 卧贴 系列:GH; Supplier Part: C3029379; Manufacturer: XUNPU(讯普); Supplier Footprint: SMD,P=1.25mm,卧贴; JLCPCB Part Class: 扩展库; Datasheet: https://atta.szlcsc.com/upload/public/pdf/source/20220527/CB8773BFB0913C3B8ABD62CB38BA101A.pdf; Supplier: LCSC; Pins Structure: 1x4P; Pitch: 1.25mm; Mounting Type: 卧贴; Reference Series: GH; Number of Pins: 4P; Number of Rows: 1; Number of PINs Per Row: 4; Current Rating: 1A; Contact Material: 黄铜; Operating Temperature: -25℃~+85℃; Voltage Rating: 125V; Plastic Material: LCP; Supplementary Features: 辅助焊脚; Color: 米色; Z-Height of the Board: 4.35mm; X-Length of Bottom Edge on Board (Spacing Line): 8.25mm; Y-Width of Bottom Edge on Board: 5mm
R1 = MCS04020Z0000ZE000: 电阻类型:薄膜电阻;阻值:0Ω;精度:-;功率:100mW;工作电压:50V;温度系数:-;; LCSC Part Name: 薄膜电阻 0Ω 100mW; Supplier Part: C2654001; Manufacturer: VISHAY(威世); Supplier Footprint: 0402; JLCPCB Part Class: Extended Part; Datasheet: https://atta.szlcsc.com/upload/public/pdf/source/20210602/C08CCF195AE51CC22ABA3E19A22B2896.pdf; Supplier: LCSC; Type: 薄膜电阻; Power(Watts): 100mW; Voltage-Supply(Max): 50V; Operating Temperature: -55℃~+155℃; Check: false
R7 = 0603WAF1001T5E: 电阻类型:厚膜电阻;阻值:1kΩ;精度:±1%;功率:100mW;最大工作电压:75V;温度系数:±100ppm/℃;; LCSC Part Name: 1kΩ ±1% 100mW 厚膜电阻; Supplier Part: C21190; Manufacturer: UNI-ROYAL(厚声); Supplier Footprint: 0603; JLCPCB Part Class: Basic Part; Datasheet: https://atta.szlcsc.com/upload/public/pdf/source/20200306/C422600_1E6D84923E4A46A82E41ADD87F860B5C.pdf; Supplier: LCSC; Type: 厚膜电阻; Tolerance: ±1%; Power(Watts): 100mW; Overload Voltage (Max): 75V; Temperature Coefficient: ±100ppm/℃; Operating Temperature Range: -55℃~+155℃
R8 R9 = 0603WAF2200T5E: 电阻类型:厚膜电阻;阻值:220Ω;精度:±1%;功率:100mW;最大工作电压:75V;温度系数:±100ppm/℃;; LCSC Part Name: 220Ω ±1% 100mW 厚膜电阻; Supplier Part: C22962; Manufacturer: UNI-ROYAL(厚声); Supplier Footprint: 0603; JLCPCB Part Class: Basic Part; Datasheet: https://atta.szlcsc.com/upload/public/pdf/source/20200306/C422600_1E6D84923E4A46A82E41ADD87F860B5C.pdf; Supplier: LCSC; Type: 厚膜电阻; Tolerance: ±1%; Power(Watts): 100mW; Overload Voltage (Max): 75V; Temperature Coefficient: ±100ppm/℃; Operating Temperature Range: -55℃~+155℃
TP1-TP4 = M2螺丝: Supplier Footprint: 插件; Check: false
U8 U10 = GT-TC029A-H030-L1N: 电路结构:单刀单掷;作用力:1.6N;安装方式:立贴;带支架:不带;触点电流:50mA;额定电压(AC):12V;额定电压(DC):12V;绝缘电阻:100MΩ;带灯:无;机械寿命:10万次;; LCSC Part Name: 3×4立式两脚小龟 无柱 160gf; Supplier Part: C19188073; Manufacturer: G-Switch(品赞); Supplier Footprint: SMD,4x3mm; JLCPCB Part Class: Extended Part; Datasheet: https://atta.szlcsc.com/upload/public/pdf/source/20231127/580118E8ED3E7C3A26AEBA02776F40AB.pdf; Supplier: LCSC; Circuit: 单刀单掷; Operating Force: 1.6N; Mounting Style: 立贴; Strike Gundam: 不带; Contact Current: 50mA; Voltage Rating (AC): 12V; Voltage Rating (DC): 12V; Insulation Resistance: 100MΩ; With Lamp: 无; Mechanical Life: 10万次
USB1 = TYPE-C 16PIN 2MD(073): 连接器类型:Type-C;标准:USB 3.1;公母:母;安装方式:卧贴;触点数量:16P;端口数量:1;额定电流 - 电源:5A;工作温度范围:-25℃~+85℃;; LCSC Part Name: Type-C 母 卧贴; Supplier Part: C2765186; Manufacturer: SHOU HAN(首韩); Supplier Footprint: SMD; JLCPCB Part Class: 扩展库; Datasheet: https://atta.szlcsc.com/upload/public/pdf/source/20211123/39B17C16241EAC15C5E277BDA434118E.pdf; Supplier: LCSC; Connector Type: Type-C; Standard: USB 3.1; Gender: 母; Mounting Style: 卧贴; Number of Contacts: 16P; Number of Ports: 1; Current Rating - Power (Max): 5A; Operating Temperature Range: -25℃~+85℃; Rated Voltage (Max): 5V; Connect-Disconnect Life: 5千次; Core Colour: 黑色

## Nets
+5V: C13.2 C31.2 C32.2 C33.2 D5.1(C) L2.2 R1.2 R11.2 U2.2(VIN) U4.3(VCC)
GND: C2.2 C3.1 C4.2 C5.1 C6.1 C7.2 C8.2 C9.1 C10.1 C11.1 C12.1 C13.1 C14.1 C15.1 C16.2 C17.1 C18.2 C20.1 C22.1 C26.1 C27.1 C29.1 C30.1 C31.1 C32.1 C33.1 C34.1 C35.2 C36.1 C37.1 C38.2 C40.1 C42.2 C43.1 C45.1 C58.1 C64.1 C65.2 D4.2(A) D5.2(A) D6.2(A) P2.3 P2.4 P7.3 P7.5 P7.6 P13.3 P13.8 P13.9 P14.3 P14.5 P14.6 Q2.1(S) Q2.2(S) Q2.3(S) Q4.1(S) Q4.2(S) Q4.3(S) Q6.1(S) Q6.2(S) Q6.3(S) R3.1 R7.1 R8.1 R9.1 R10.2 R13.2 R14.2 R16.2 R18.2 R20.2 R22.2 R28.1 U1.12(VSSA) U1.18(VSS) U1.63(VSS) U2.1(GND) U4.2(GND) U4.8(S) U5.4(GND) U5.6(REF2) U6.4(GND) U6.6(REF2) U7.4(GND) U7.6(REF2) U8.1 U9.28(AGND) U9.30(SP2) U9.31(SN2) U9.32(SP1) U9.33(SN1) U9.34(SL-C) U9.39(SL-B) U9.44(SL-A) U9.57(EP) USB1.1(GND) USB1.12(GND) USB1.13(SHELL) USB1.14(SHELL) X1.2(GND) X1.4(GND)
VCC: C5.2 C6.2 C9.2 C10.2 C11.2 C12.2 C34.2 C35.1 C38.1 C42.1 C64.2 D1.1(+) P7.4 P13.1 P14.1 R2.2 R27.2 R39.2 U1.1(VBAT) U1.13(VDDA) U1.19(VDD) U1.32(VDD) U1.48(VDD) U1.64(VDD) U2.3(VOUT) U4.5(VIO) U5.5(VS) U5.7(REF1) U6.5(VS) U6.7(REF1) U7.5(VS) U7.7(REF1) U9.49(VDD-SPI) U10.2
ADC_15: U1.25(PC5)
ADC_TEMP: C36.2 R27.1 R28.2 U1.17(PA3)
AN_IN: R15.1 R16.1 U1.11(PC3)
BOOT0: R3.2 U1.60(BOOT0) U10.1
C_A: R35.2 U5.8(OUT)
C_B: R36.2 U6.8(OUT)
C_C: R37.2 U7.8(OUT)
CAN_RX: U1.61(PB8) U4.4(RXD)
CAN_TX: U1.62(PB9) U4.1(TXD)
CANH: P2.2 R23.2 U4.7(CANH)
CANL: P2.1 R23.1 U4.6(CANL)
CS: U1.40(PC9) U9.8(NSCS)
CURRENT_1: C29.2 R35.1 U1.8(PC0)
CURRENT_2: C30.2 R36.1 U1.9(PC1)
CURRENT_3: C45.2 R37.1 U1.10(PC2)
EN_GATE: U1.57(PB5) U9.16(EN-GATE)
FAULT: U1.59(PB7) U9.6(NFAULT)
GH_A: R25.1 U9.47(GH-A)
GH_B: R30.1 U9.42(GH-B)
GH_C: R33.1 U9.37(GH-C)
GL_A: R26.1 U9.45(GL-A)
GL_B: R31.1 U9.40(GL-B)
GL_C: R34.1 U9.35(GL-C)
H1: U1.41(PA8) U9.17(INH-A)
H2: U1.42(PA9) U9.19(INH-B)
H3: U1.43(PA10) U9.21(INH-C)
HALL_1: U1.37(PC6)
HALL_2: U1.38(PC7)
HALL_3: U1.39(PC8)
INL_A: U1.34(PB13) U9.18(INL-A)
INL_B: U1.35(PB14) U9.20(INL-B)
INL_C: U1.36(PB15) U9.22(INL-C)
LED_GREEN: D3.1(A) U1.26(PB0)
LED_RED: D2.1(+) U1.27(PB1)
MISO_ADC_EXT2: P13.4 P14.4 U1.22(PA6)
NRST: C7.1 R2.1 U1.7(NRST) U8.2
PB3: U1.55(PB3(JTDOTRACESWO))
PB4: U1.56(PB4(NJTRST))
PB12: U1.33(PB12)
PD2: U1.54(PD2)
PH_A: R24.1 U5.3(IN-)
PH_B: R29.1 U6.3(IN-)
PH_C: R32.1 U7.3(IN-)
RX_SDA_NSS: U1.20(PA4) U1.30(PB11)
SCK_ADC_EXT: P13.2 P14.2 U1.21(PA5)
SCLK: U1.51(PC10) U9.11(SCLK)
SDI: U1.53(PC12) U9.9(SDI)
SDO: U1.52(PC11) U9.10(SDO)
SENS_A: R17.1 R18.1 U1.14(PA0-WKUP(PA0))
SENS_B: R19.1 R20.1 U1.15(PA1)
SENS_C: R21.1 R22.1 U1.16(PA2)
SERVO: U1.58(PB6)
SH_A: C23.2 Q1.1(S) Q1.2(S) Q1.3(S) Q2.5(D) R17.2 R24.2 U5.2(IN+) U9.46(SH-A)
SH_B: C24.1 Q3.1(S) Q3.2(S) Q3.3(S) Q4.5(D) R19.2 R29.2 U6.2(IN+) U9.41(SH-B)
SH_C: C25.1 Q5.1(S) Q5.2(S) Q5.3(S) Q6.5(D) R21.2 R32.2 U7.2(IN+) U9.36(SH-C)
SUPPLY: C26.2 C27.2 C37.2 C40.2 C43.2 C65.1 D6.1(K) Q1.5(D) Q3.5(D) Q5.5(D) R15.2 U9.29(PVDD1) U9.53(PVDD2) U9.54(PVDD2)
SWCLK: P7.2 U1.49(PA14(JTCK-SWCLK))
SWDIO: P7.1 U1.46(PA13(JTMS-SWDIO))
TEMP_MOTOR: C58.2 P13.5 R39.1 U1.24(PC4)
TX_SCL_MOSI: U1.23(PA7) U1.29(PB10)
USB_DM: U1.44(PA11) USB1.5(DN2) USB1.7(DN1)
USB_DP: U1.45(PA12) USB1.6(DP1) USB1.8(DP2)
$1N80571: R1.1 USB1.2(VBUS) USB1.11(VBUS)
$1N82503: D3.2(K) R9.2
$1N82508: D1.2(-) R7.2
$1N82510: D2.2(-) R8.2
$2N17028: C8.1 U1.6(PH1-OSC_OUT(PH1)) X1.3
$2N17034: C3.2 U1.31(VCAP_1)
$2N17046: C4.1 U1.47(VCAP_2)
$2N17057: C2.1 U1.5(PH0-OSC_IN(PH0)) X1.1
$3N7256: C28.1 U9.52(BST-BK)
$3N7259: C28.2 D4.1(K) L2.1 U9.50(PH) U9.51(PH)
$3N7261: C23.1 U9.48(BST-A)
$3N7263: C24.2 U9.43(BST-B)
$3N7265: C25.2 U9.38(BST-C)
$3N7281: R10.1 R11.1 U9.3(VSENSE)
$3N7282: C16.1 R12.2
$3N7283: R14.1 U9.1(RT-CLK)
$3N7285: C18.1 R12.1 U9.2(COMP)
$3N7287: R13.1 U9.7(DTC)
$3N7289: C19.1 U9.14(CP1)
$3N7290: C19.2 U9.15(CP2)
$3N7291: C14.2 C15.2 U9.13(GVDD)
$3N7294: C20.2 U9.24(REF) U9.27(AVDD)
$3N7296: C17.2 U9.23(DVDD)
$3N10171: C22.2 U9.56(SS-TR)
$4N40844: Q4.4(G) R31.2
$4N41325: Q2.4(G) R26.2
$4N41715: Q3.4(G) R30.2
$4N41799: Q1.4(G) R25.2
$4N42241: Q5.4(G) R33.2
$4N42270: Q6.4(G) R34.2

Not connected (* = marked no-connect by the designer): P13 6* 7*; TP1 1*; TP2 1*; TP3 1*; TP4 1*; U1 2(PC13)* 3(PC14-OSC32_IN(PC14))* 4(PC15-OSC32_OUT(PC15))* 28(PB2-BOOT1(PB2))* 50(PA15(JTDI))*; U5 1(NC)*; U6 1(NC)*; U7 1(NC)*; U9 4(PWRGD)* 5(NOCTW)* 12(DC-CAL)* 25(SO1)* 26(SO2)* 55(EN-BUCK)*; USB1 3(SBU2)* 4(CC1)* 9(SBU1)* 10(CC2)*

## Notes on the sheets
sheet 1
- MCU
- DRV8301
- Power
- CAN
sheet 2
- (NC)
- (NC)
- (NC)
- (NC)
- (NC)
- (NC)
- (NC)
- (NC)
- (NC)
- (NC)
- (NC)
- (NC)
- (NC)
